# EAGLE design Zio Qwiic Loudness Sensor (EAGLE 9.2.2)
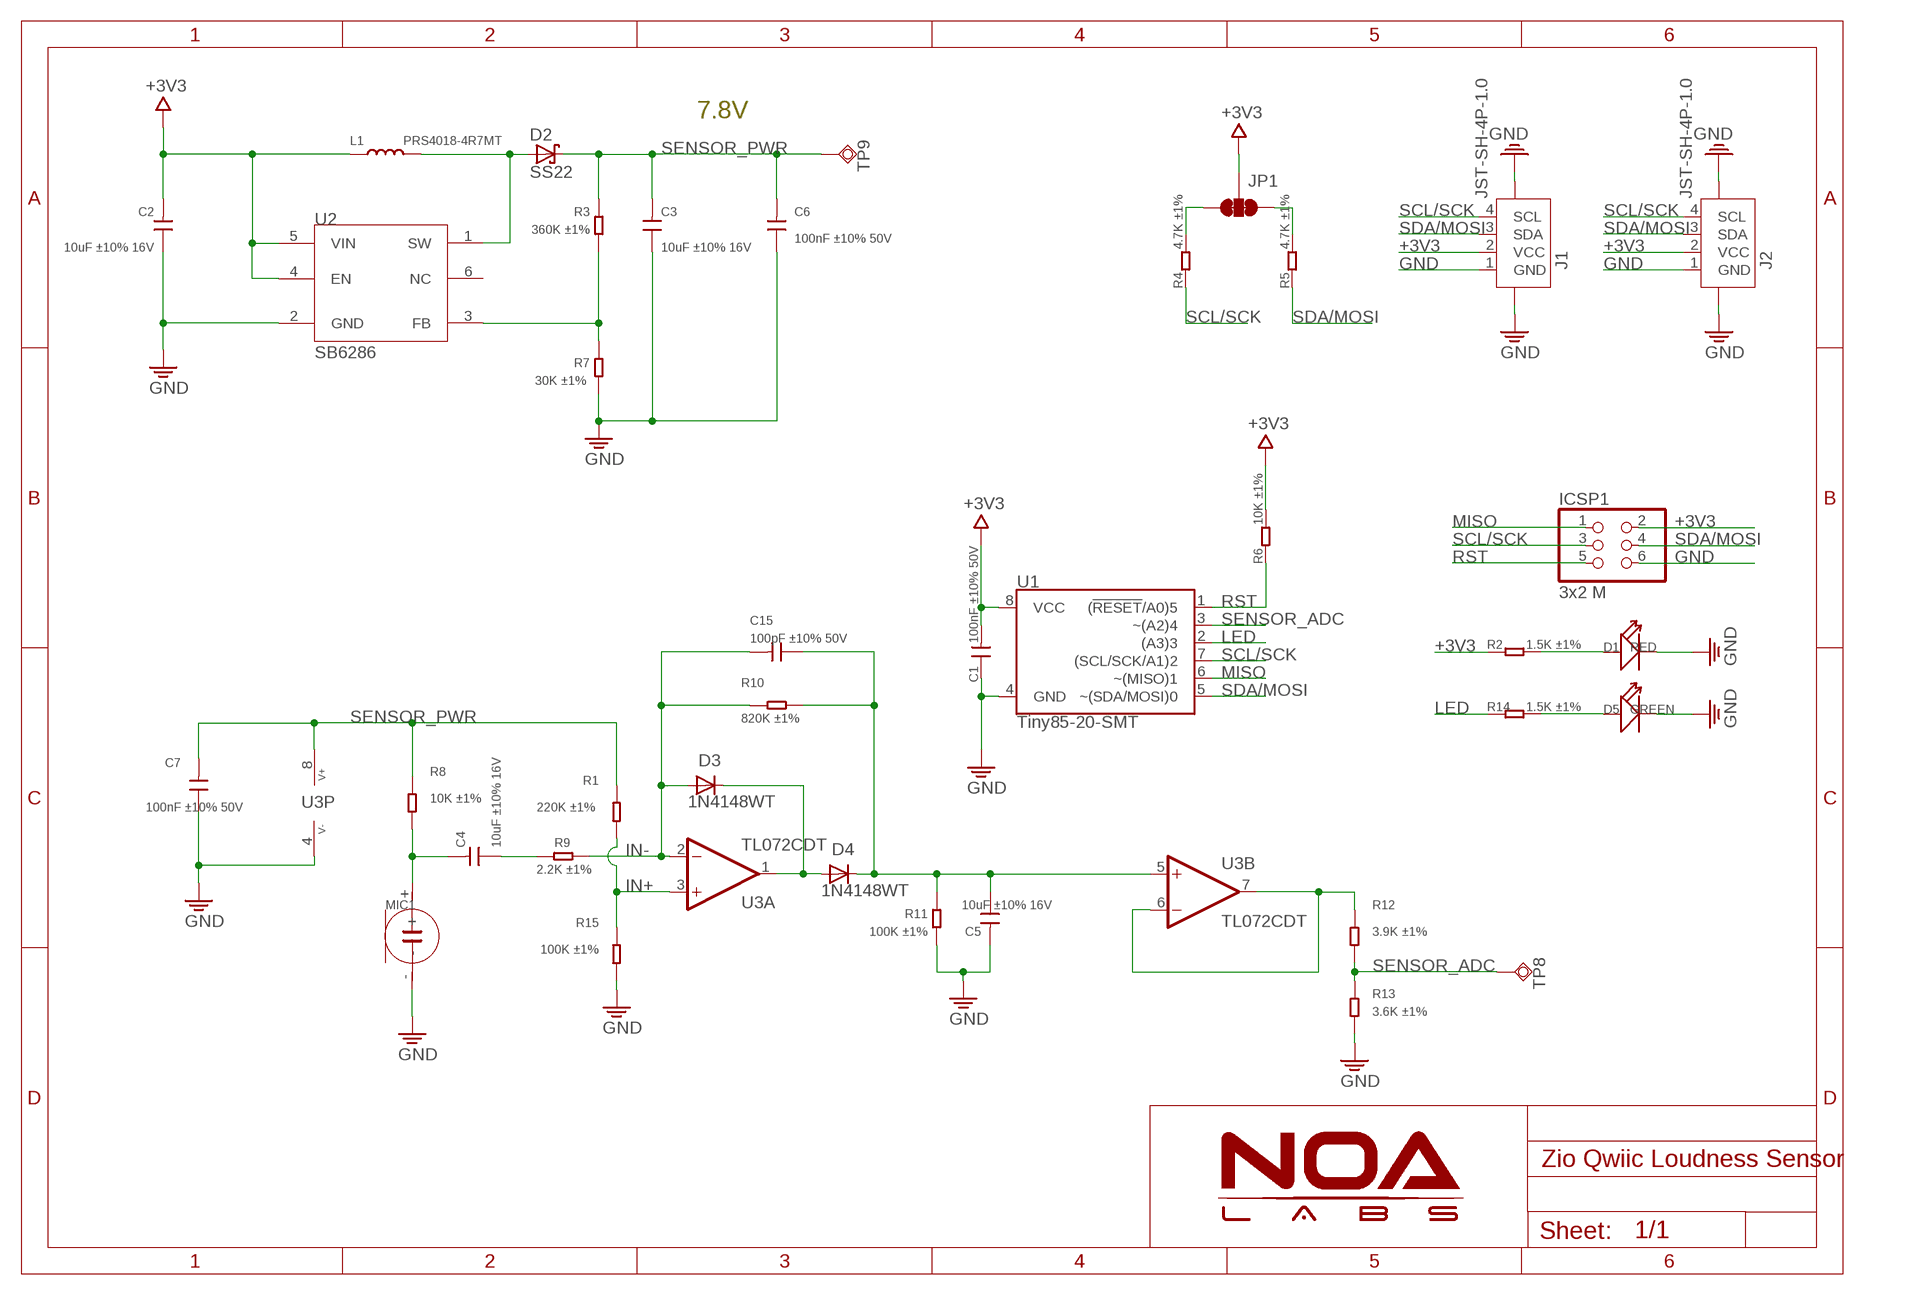
[diagram p0: schematic, sheet 1]

## Parts
C1  100nF ±10% 50V  C-0603  [C0603]
C2  10uF ±10% 16V  C-0603  [C0603]
C3  10uF ±10% 16V  C-0603  [0603]
C4  10uF ±10% 16V  C-0603  [0603]
C5  10uF ±10% 16V  C-0603  [0603]
C6  100nF ±10% 50V  C-0603  [C0603]
C7  100nF ±10% 50V  C-0603  [C0603]
C15  100pF ±10% 50V  C-0603  [C0603]
D1  RED  LED'0603'  [LED-0603]
D2  SS22  SCHOTTKY  [SMA]
D3  1N4148WT  BA277  [SOD523]
D4  1N4148WT  BA277  [SOD523]
D5  GREEN  LED'0603'  [LED-0603]
ICSP1  3x2 M  PINHD-2X3  [2X03]
J1  JST-SH-4P-1.0  [JST-SH-4P]
J2  JST-SH-4P-1.0  [JST-SH-4P]
JP1  SMT-JUMPER_3_2-NC_TRACE  [SMT-JUMPER_3_2-NC_TRACE]
L1  PRS4018-4R7MT  L-4030  [L4030]
MIC1  MIC-2P(EAO-9745-PFA-C1033-28-008)  [MIC2-D9.7XH4.5MM]
R1  220K ±1%  R-0603  [R0603]
R2  1.5K ±1%  R-0603  [R0603]
R3  360K ±1%  R-0603  [R0603]
R4  4.7K ±1%  R-0603  [R0603]
R5  4.7K ±1%  R-0603  [R0603]
R6  10K ±1%  R-0603  [R0603]
R7  30K ±1%  R-0603  [R0603]
R8  10K ±1%  R-0603  [R0603]
R9  2.2K ±1%  R-0603  [R0603]
R10  820K ±1%  R-0603  [R0603]
R11  100K ±1%  R-0603  [R0603]
R12  3.9K ±1%  R-0603  [R0603]
R13  3.6K ±1%  R-0603  [R0603]
R14  1.5K ±1%  R-0603  [R0603]
R15  100K ±1%  R-0603  [R0603]
TP8  TPSQTP08R  [TP08R]
TP9  TPSQTP12R  [TP12R]
U1  Tiny85-20-SMT  ATTINY85-ARDUINOTINY85-20-SMT  [SO08-EIAJ_MCU]
U2  SB6286  SDB628  [SOT23-6]
U3  TL072CDT  TL072D  [SO08]

## Nets
+3V3: C1.2 C2.2 ICSP1.2 J1.2(VCC) J2.2(VCC) JP1.2 L1.1 R2.1 R6.2 U1.8(VCC) U2.4(EN) U2.5(VIN)
GND: C1.1 C2.1 C3.1 C5.2 C6.1 C7.1 D1.- D5.- ICSP1.6 J1.1(GND) J1.NC1 J1.NC2 J2.1(GND) J2.NC1 J2.NC2 MIC1.- R7.1 R11.1 R13.1 R15.1 U1.4(GND) U2.2(GND) U3.4(P:V-)
IN+: R1.1 R15.2 U3.3(A:+IN)
IN-: C15.2 D3.2(A) R9.1 R10.1 U3.2(A:-IN)
LED: R14.1 U1.2((A3)3)
MISO: ICSP1.1 U1.6(~(MISO)1)
N$1: D1.+ R2.2
N$2: R12.2 U3.6(B:-IN) U3.7(B:OUT)
N$3: C5.1 C15.1 D4.1(K) R10.2 R11.2 U3.5(B:+IN)
N$4: R3.1 R7.2 U2.3(FB)
N$5: D5.+ R14.2
N$6: JP1.3 R4.2
N$7: D3.1(K) D4.2(A) U3.1(A:OUT)
N$8: JP1.1 R5.2
N$9: C4.2 MIC1.+ R8.1
N$11: C4.1 R9.2
RST: ICSP1.5 R6.1 U1.1((!RESET!/A0)5)
SCL/SCK: ICSP1.3 J1.4(SCL) J2.4(SCL) R4.1 U1.7((SCL/SCK/A1)2)
SDA/MOSI: ICSP1.4 J1.3(SDA) J2.3(SDA) R5.1 U1.5(~(SDA/MOSI)0)
SENSOR_ADC: R12.1 R13.2 TP8.TP U1.3(~(A2)4)
SENSOR_PWR: C3.2 C6.2 C7.2 D2.P$1(C) R1.2 R3.2 R8.2 TP9.TP U3.8(P:V+)
SW: D2.P$2(A) L1.2 U2.1(SW)
Unconnected: U2.6(NC)

## Notes on the sheet
- 7.8V

## Library data of the parts
C1 C2 C6 C7 C15 = RCL:C
C3-C5 = Discrete:C*: Ceramic Capacitors
D1 D5 = Discrete_NOA:LED*
D2 = Discrete:SCHOTTKY
D3 D4 = nxp_60_1_1:BA277: Band-switching diode Planar high performance band-switching diode in a small plastic SOD523 (SC-79) SMD package. AAL Eindhoven MK
ICSP1 = SmartPrj:PINHD-2X3: PIN HEADER
J1 J2 = Connector:JST-SH-4P
JP1 = NOA-Jumpers:SMT-JUMPER_3_2-NC_TRACE
L1 = Discrete:L*
MIC1 = Seeed-OPL-Connector:MIC-2P(EAO-9745-PFA-C1033-28-008): 312030029; MPN: EAO-9745-PFA-C1033-28-008; VALUE: EAO-9745-PFA-C1033-28-008
R1-R15 = RCL:R
TP8 TP9 = testpad:TPSQ: Test pad
U1 = Qwiic-Bluetooth-HC1x:ATTINY85-ARDUINO: Atmel 8-pin 2/4/8kB flash uC; PROD_ID: IC-09092
U2 = IC:SDB628
U3 = linear:TL072: OP AMP

## Board
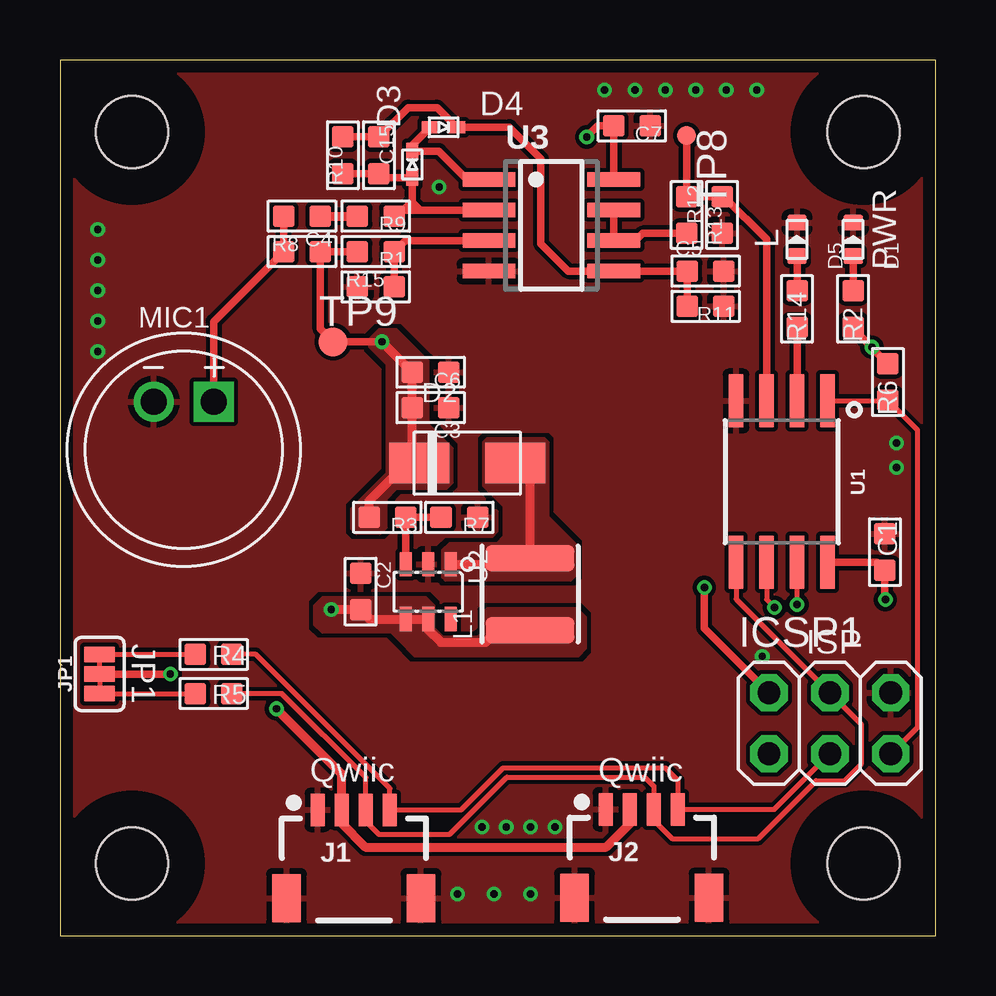
[diagram p1: board, top side]
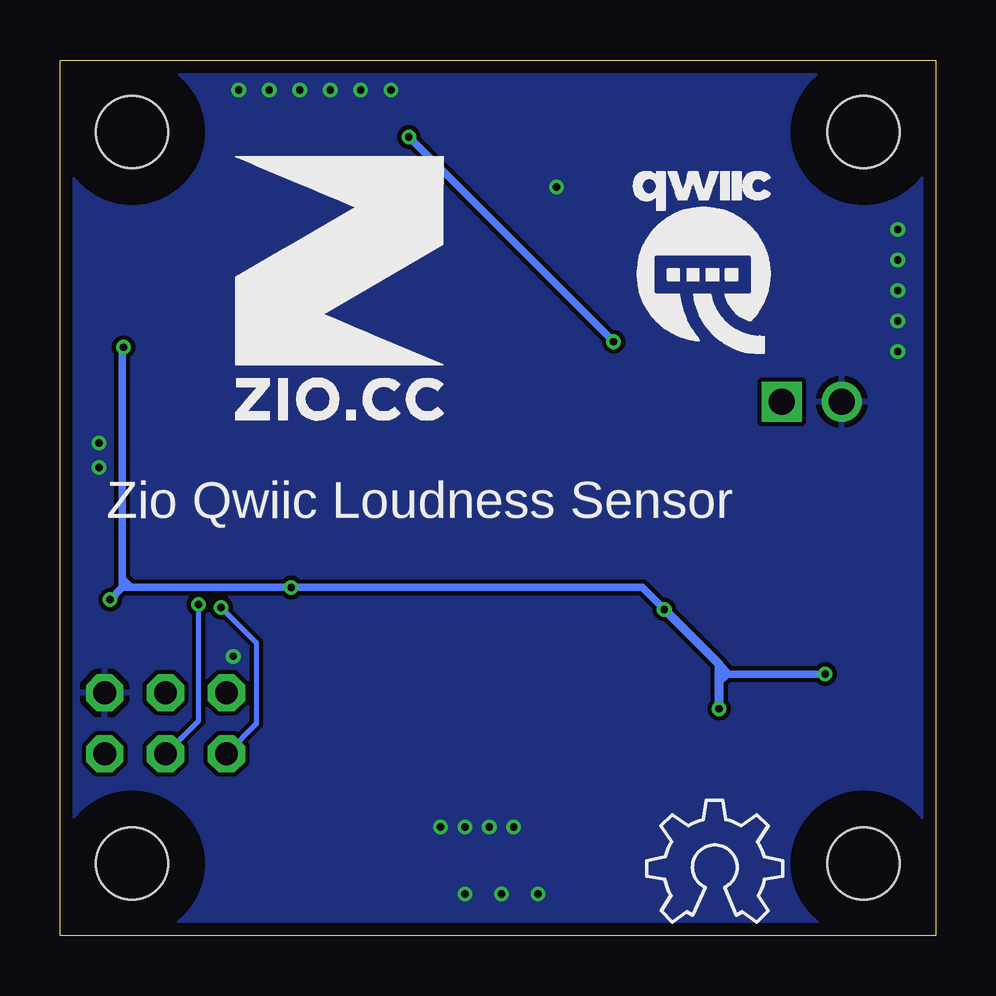
[diagram p2: board, bottom side, seen from below]

Size 36.48 x 36.48 mm. Coordinates in mm from the lower left corner, seen from the top.
Outline: 0,0 36.48,0 36.48,36.48 0,36.48 0,0
Copper layers (1*16): Top 0.035mm / dielectric 1.5mm / Bottom 0.035mm
Design rules "NOA Eagle Rule": minimum track width 7mil, minimum drill 12mil, track to track 7mil, track to pad 7mil, pad to pad 7mil, via to via 7mil, smd to smd 0mil, copper to edge 20mil, drill to drill 10mil, minimum pad ring 10mil, minimum via ring 6mil, stop-mask expansion 2mil, vias tented up to drill 25mil, thermal gap 10mil
Holes 3 mm at 3,3 33.48,3 3,33.48 33.48,33.48
tRestrict: area 0,0 to 6,6; area 30.5,0 to 36.4,6; area 30.5,30.5 to 36.4,36.4; area 0,30.5 to 6,36.4
bRestrict: area 0,0 to 6,6; area 30.5,0 to 36.4,6; area 30.5,30.5 to 36.4,36.4; area 0,30.5 to 6,36.4

### Footprints (pad centres in the part's own frame; a part is rotated, then mirrored left to right if it is on the bottom)
C0603 = smd 0.889 x 0.889: 1 -0.762,0; 2 0.762,0
0603 = smd 0.889 x 0.889: 1 -0.762,0; 2 0.762,0
LED-0603 = smd 0.635 x 0.8: + 0.699,0; - -0.699,0
SMA = smd 2.5 x 1.7: P$1 -2,0; P$2 2,0
SOD523 = smd 0.7 x 0.5: 1 0.55,0; 2 -0.55,0
2X03 = drill 0.95 pad 1.55 octagon: 1 -2.54,-1.27; 2 -2.54,1.27; 3 0,-1.27; 4 0,1.27; 5 2.54,-1.27; 6 2.54,1.27
JST-SH-4P = smd 0.6 x 1.35: 1 1.5,0; 2 0.5,0; 3 -0.5,0; 4 -1.5,0 | smd 1.2 x 2: NC1 -2.8,3.675; NC2 2.8,3.675
SMT-JUMPER_3_2-NC_TRACE = smd 0.635 x 1.27: 1 -0.813,0; 2 0,0; 3 0.813,0
L4030 = smd 1.1 x 3.7: 1 -1.5,0; 2 1.5,0
MIC2-D9.7XH4.5MM = drill 1.1 square: + 1.25,2 | drill 1.1: - -1.25,2
R0603 = smd 0.889 x 0.889: 1 -0.762,0; 2 0.762,0
TP08R = smd 0.8 x 0.8: TP 0,0
TP12R = smd 1.2 x 1.2: TP 0,0
SO08-EIAJ_MCU = smd 0.61 x 2.21: 1 -1.905,-3.378; 2 -0.635,-3.378; 3 0.635,-3.378; 4 1.905,-3.378; 5 1.905,3.353; 6 0.635,3.353; 7 -0.635,3.353; 8 -1.905,3.353
SOT23-6 = smd 0.508 x 1.016: 1 -0.94,-1.143; 2 0,-1.143; 3 0.94,-1.143; 4 0.94,1.143; 5 0,1.143; 6 -0.94,1.143
SO08 = smd 0.6 x 2.2: 1 -1.905,-2.6; 2 -0.635,-2.6; 3 0.635,-2.6; 4 1.905,-2.6; 5 1.905,2.6; 6 0.635,2.6; 7 -0.635,2.6; 8 -1.905,2.6

### Placement (x,y rotation side)
C1  34.37,15.98 270 top
C2  12.52,14.33 270 top
C3  15.44,22 180 top
C4  10.08,29.97 180 top
C5  26.9,27.69 0 top
C6  15.44,23.47 180 top
C7  23.83,33.73 180 top
C15  13.28,32.51 270 top
D1  33.05,29.01 270 top
D2  16.97,19.68 0 top
D3  14.68,32.13 90 top
D4  15.98,33.68 0 top
D5  30.71,29.01 270 top
ICSP1  32.08,8.84 0 top
J1  12.24,5.23 180 top
J2  24.24,5.26 180 top
JP1  1.65,10.9 90 top
L1  19.58,14.22 90 top
MIC1  5.16,20.24 0 top
R1  13.16,28.5 180 top
R2  33.05,26.11 90 top
R3  13.64,17.42 180 top
R4  6.4,11.71 180 top
R5  6.4,10.08 180 top
R6  34.49,23.06 90 top
R7  16.64,17.42 180 top
R8  10.08,28.5 0 top
R9  13.16,29.97 180 top
R10  11.79,32.51 90 top
R11  26.9,26.21 180 top
R12  26.11,30.02 270 top
R13  27.58,30.02 90 top
R14  30.71,26.11 90 top
R15  13.16,27.03 0 top
TP8  26.11,33.32 270 top
TP9  11.38,24.74 0 top
U1  30.07,18.9 180 top
U2  15.34,14.33 180 top
U3  20.47,29.59 270 top
U$3  [11MM]  29.18,21.49 0 bottom
U$4  [QWIIC-LOGO-LARGE]  9.86,28.04 0 bottom
U$5  [OSHW_6X200_NOTEXT]  12.04,0.56 0 bottom

### Tracks (layer width: path | path; a pad name or v marks a point on that pad's centre or on a via)
+3V3  (via drill 0.3)
  Top 0.305: JP1.2 v4.6,10.9 | U1.8 34.04,15.54 C1.2 34.37,14.02 v34.39,13.99 | R2.1 33.05,25.27 R6.2 33.83,24.49 v33.83,24.51 | ICSP1.2 26.85,12.8 v26.85,14.5
  Top 0.381: J2.2 23.74,4.67 22.76,3.68 12.72,3.68 11.74,4.67 J1.2 11.74,6.73 v9.02,9.45 | v11.3,13.59 12.5,13.59 C2.2 12.9,13.18 U2.4 U2.5 15.34,12.75 15.88,12.22 17.73,12.22 18.24,12.72 L1.1
  Bottom 0.305: v4.6,10.9 8.61,10.9 | 8.61,10.9 9.02,11.3 | 8.61,10.9 8.69,10.9 9.02,10.57 | v34.39,13.99 33.88,14.5 | v11.3,13.59 12.22,14.5 v26.85,14.5 33.53,14.5 | 33.88,14.5 33.53,14.5 | 33.88,14.5 33.88,14.86 | v33.83,24.51 33.88,24.46 33.88,14.99 33.88,14.86 | 33.53,14.5 33.88,14.86
  Bottom 0.381: v9.02,9.45 9.02,10.57 9.02,11.3 v11.3,13.59
  pour Top (no thermals): 11.18,14.07 15.24,14.07 15.57,13.74 15.57,12.8 15.95,12.42 17.42,12.42 17.63,12.62 17.63,13.44 17.81,13.61 21.54,13.61 21.89,13.26 21.89,11.96 21.59,11.66 14.78,11.66 14.15,12.29 13.79,12.65 11.18,12.65 10.92,12.65 10.62,12.95 10.62,13.74 10.82,13.94 10.95,14.07
GND  (via drill 0.3)
  other vias: 17.58,4.52 18.59,4.52 19.61,4.52 20.62,4.52 15.8,31.19 29.26,11.63 29.03,35.23 27.76,35.23 26.49,35.23 25.22,35.23 23.95,35.23 22.68,35.23 1.57,29.41 1.57,28.14 1.57,26.87 1.57,25.6 1.57,24.33 19.61,1.73 18.08,1.73 16.56,1.73 34.85,20.52 34.85,19.51
  pour Top (rank 2): 0,36.47 36.47,36.47 36.47,0 0,0
  pour Bottom: 0,36.47 36.47,36.47 36.47,0 0,0
IN+
  Top 0.305: U3.3 14.38,28.96 R1.1 R15.2
IN-
  Top 0.305: U3.2 15.01,30.23 | 15.01,30.23 14.3,30.23 | 14.68,30.61 D3.2 13.45,31.58 C15.2 R10.1 | 14.68,30.61 14.3,30.23 | 14.68,30.61 14.68,30.56 15.01,30.23 | 14.3,30.23 13.92,30.23 R9.1
LED
  Top 0.305: R14.1 U1.2
MISO  (via drill 0.3)
  Top 0.203: U1.6 29.44,13.99 v29.77,13.66
  Bottom 0.203: v29.77,13.66 28.3,12.19 28.3,8.81 ICSP1.1
N$1
  Top 0.305: R2.2 D1.+
N$2
  Top 0.305: U3.7 U3.6 23.98,28.96 24.28,29.26 R12.2
N$3
  Top 0.305: R11.2 C5.1 U3.5 21.18,27.69 20.04,28.83 20.04,32.36 18.72,33.68 D4.1 15.71,34.49 14.5,34.49 C15.1 R10.2
N$4
  Top 0.305: U2.3 R3.1 R7.2
N$5
  Top 0.305: D5.+ R14.2
N$6
  Top 0.203: JP1.3 R4.2
N$7
  Top 0.305: U3.1 16.97,31.5 15.78,32.68 D3.1 14.68,32.94 D4.2
N$8
  Top 0.203: JP1.1 R5.2
N$9
  Top 0.305: C4.2 R8.1 6.41,25.58 MIC1.+
N$11
  Top 0.381: C4.1 R9.2
RST
  Top 0.203: ICSP1.5 35.74,8.69 35.74,21.06 R6.1 34.47,22.28 U1.1
SCL/SCK  (via drill 0.3)
  Top 0.203: R4.1 8.16,11.71 13.74,6.13 J1.4 16.71,5.23 18.47,6.99 25.22,6.99 25.74,6.47 J2.4 29.77,5.26 ICSP1.3 | v30.71,13.79 U1.7
  Bottom 0.203: ICSP1.3 30.71,8.94 v30.71,13.79
SDA/MOSI
  Top 0.203: R5.1 9.25,10.08 12.74,6.59 J1.3 12.74,4.76 13.28,4.22 16.24,4.22 18.62,6.6 24.36,6.6 24.74,6.22 J2.3 24.74,4.8 25.5,4.04 29.09,4.04 31.5,6.45 32.69,6.45 33.4,7.16 33.4,8.79 ICSP1.4 28.17,14.02 U1.5
SENSOR_ADC
  Top 0.305: TP8.TP R12.1 R13.2 27.66,30.79 29.44,29.01 U1.3
SENSOR_PWR  (via drill 0.3)
  Top 0.305: v13.41,24.74 TP9.TP 10.85,25.27 R8.2 R1.2 | v21.95,33.27 22.4,33.73 C7.2 U3.8
  Top 0.381: v13.41,24.74 C6.2 C3.2 14.68,19.68 D2.P$1 14.45,19.68 12.88,18.11 R3.2
  Bottom 0.305: v13.41,24.74 v21.95,33.27
  pour Top (no thermals): 12.17,17.35 12.17,17.78 13.64,19.25 13.64,23.8 12.9,24.54 12.9,24.84 13.16,25.1 13.31,25.25 13.77,25.25 14.02,25.25 15.16,24.1 15.32,23.95 15.32,21.31 16.33,20.29 16.33,18.9 16.33,18.87 16.1,18.64 14.02,18.64 13.56,18.19 13.56,17.32 13.56,16.99 13.34,16.76 12.34,16.76 12.27,16.84 12.17,16.94
SW
  Top 0.381: U2.1 19.33,15.47 L1.2 19.58,19.07 D2.P$2
  pour Top (no thermals): 17.02,16.33 18.21,16.33 18.52,16.64 18.52,17.88 17.65,18.75 17.65,20.55 17.81,20.7 20.17,20.7 20.32,20.55 20.32,17.45 21.51,16.26 21.51,15.06 21.29,14.83 16.05,14.83 16,14.88 15.95,14.94 15.95,16.05 16.23,16.33

### Text on the board
tPlace: L | PWR | JP1 | ISP | Qwiic | Qwiic
bPlace: Zio Qwiic Loudness Sensor